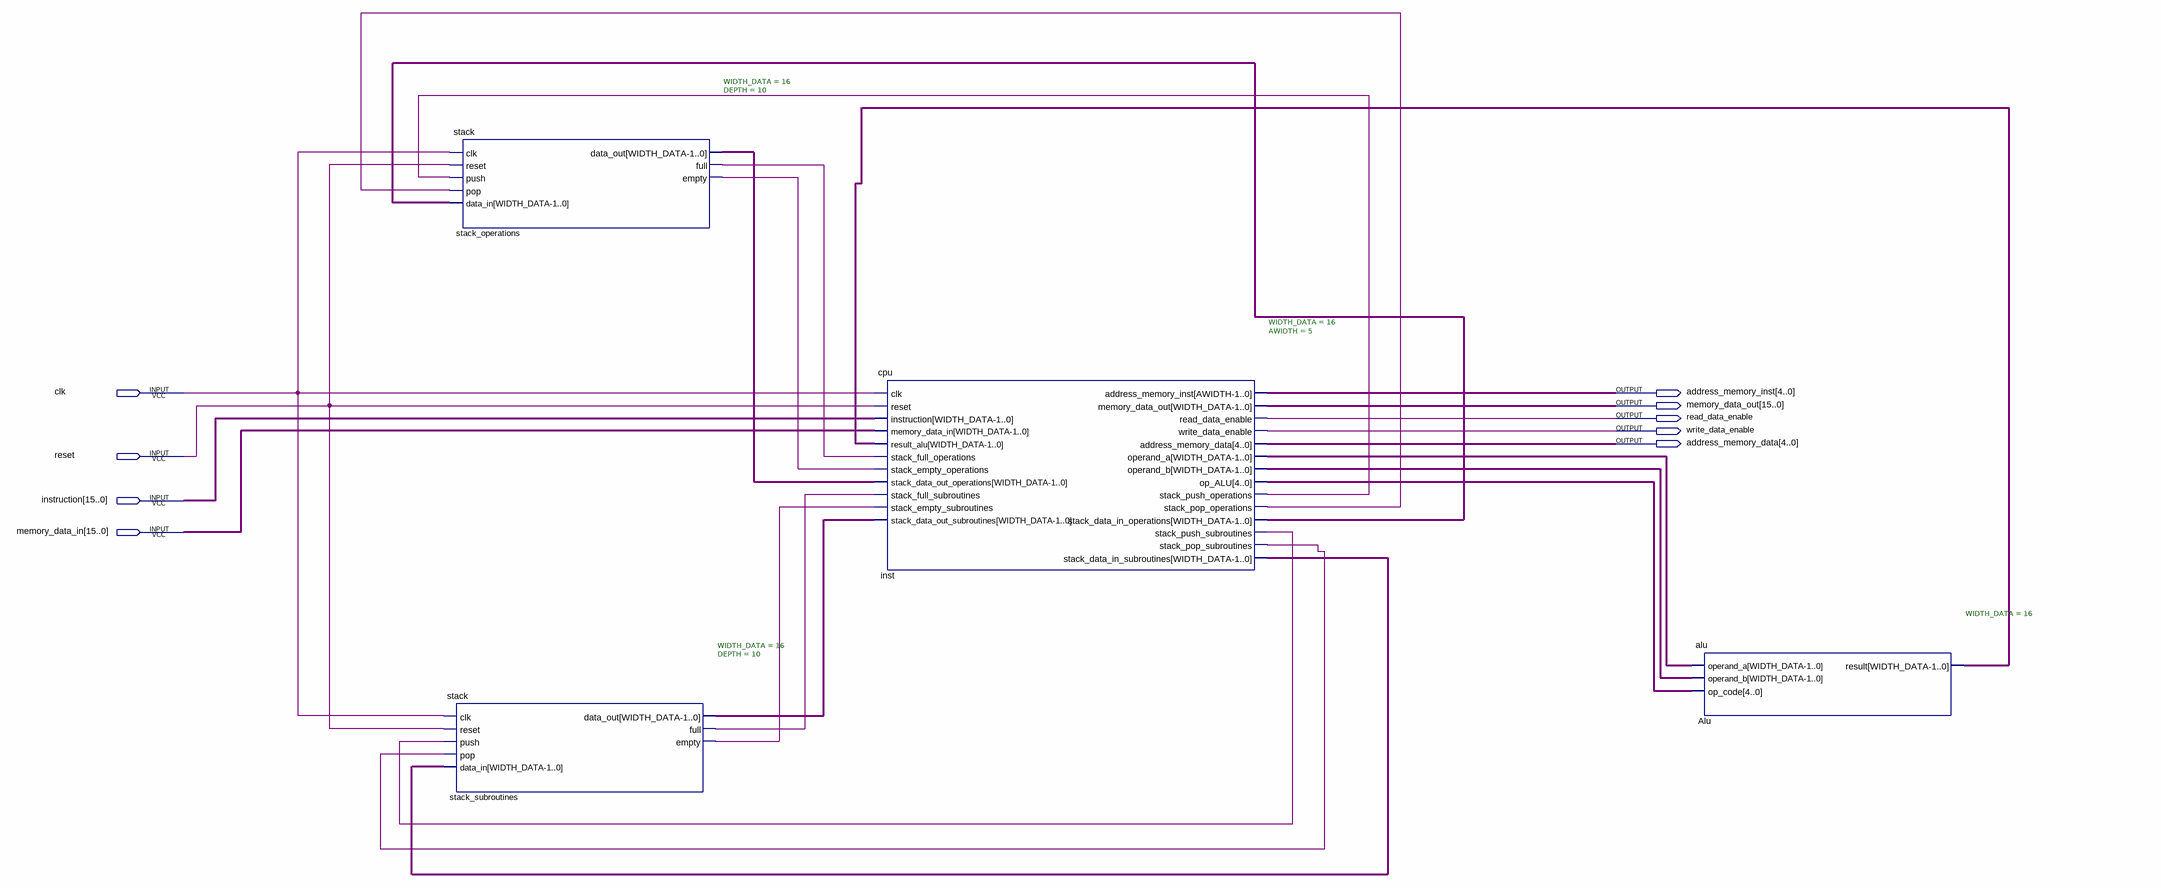
[diagram p0: schematic sheet]
// Quartus schematic Processor.bdf as structural Verilog: 4 symbols, 9 pins
module Processor (
  input  clk,
  input  reset,
  input  [15:0] instruction,
  input  [15:0] memory_data_in,
  output [4:0] address_memory_inst,
  output [15:0] memory_data_out,
  output read_data_enable,
  output write_data_enable,
  output [4:0] address_memory_data
);

  wire inst_stack_pop_operations, inst_stack_pop_subroutines, inst_stack_push_operations,
       inst_stack_push_subroutines, stack_operations_empty, stack_operations_full, stack_subroutines_empty,
       stack_subroutines_full;
  wire [4:0] inst_op_alu;
  wire [15:0] Alu_result, inst_operand_a, inst_operand_b, inst_stack_data_in_operations,
       inst_stack_data_in_subroutines, stack_operations_data_out, stack_subroutines_data_out;

  stack #(.WIDTH_DATA(16), .DEPTH(10)) stack_operations (
    .clk(clk), .reset(reset), .push(inst_stack_push_operations), .pop(inst_stack_pop_operations),
    .data_in(inst_stack_data_in_operations), .data_out(stack_operations_data_out),
    .full(stack_operations_full), .empty(stack_operations_empty));
  stack #(.WIDTH_DATA(16), .DEPTH(10)) stack_subroutines (
    .clk(clk), .reset(reset), .push(inst_stack_push_subroutines), .pop(inst_stack_pop_subroutines),
    .data_in(inst_stack_data_in_subroutines), .data_out(stack_subroutines_data_out),
    .full(stack_subroutines_full), .empty(stack_subroutines_empty));
  cpu #(.WIDTH_DATA(16), .AWIDTH(5)) inst (
    .clk(clk), .reset(reset), .instruction(instruction), .memory_data_in(memory_data_in),
    .result_alu(Alu_result), .stack_full_operations(stack_operations_full),
    .stack_empty_operations(stack_operations_empty), .stack_data_out_operations(stack_operations_data_out),
    .stack_full_subroutines(stack_subroutines_full), .stack_empty_subroutines(stack_subroutines_empty),
    .stack_data_out_subroutines(stack_subroutines_data_out), .address_memory_inst(address_memory_inst),
    .memory_data_out(memory_data_out), .read_data_enable(read_data_enable),
    .write_data_enable(write_data_enable), .address_memory_data(address_memory_data),
    .operand_a(inst_operand_a), .operand_b(inst_operand_b), .op_ALU(inst_op_alu),
    .stack_push_operations(inst_stack_push_operations), .stack_pop_operations(inst_stack_pop_operations),
    .stack_data_in_operations(inst_stack_data_in_operations),
    .stack_push_subroutines(inst_stack_push_subroutines), .stack_pop_subroutines(inst_stack_pop_subroutines),
    .stack_data_in_subroutines(inst_stack_data_in_subroutines));
  alu #(.WIDTH_DATA(16)) Alu (
    .operand_a(inst_operand_a), .operand_b(inst_operand_b), .op_code(inst_op_alu), .result(Alu_result));
endmodule
